# EAGLE schematic unoedge_v1 (EAGLE 7.2.0)
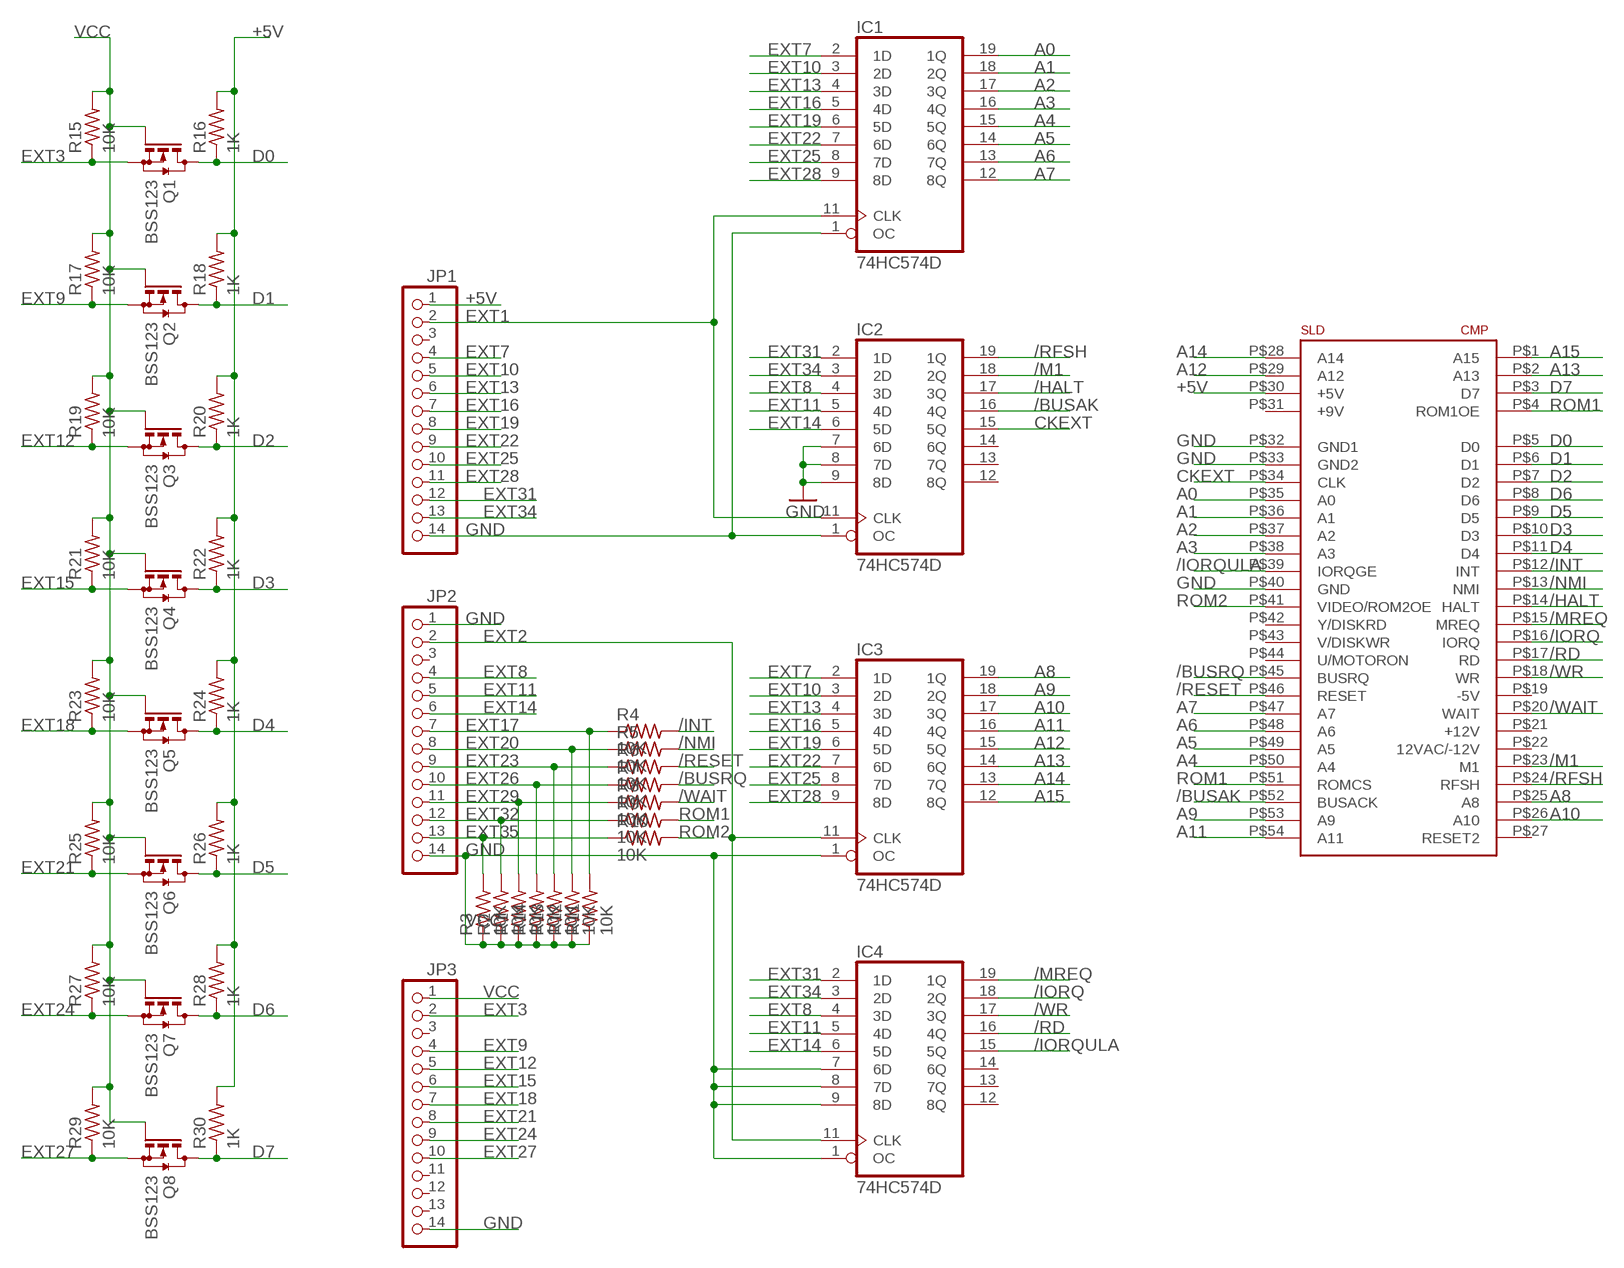
[diagram p0: schematic, sheet 1]

## Parts
IC1  74HC574D  [SO20W]
IC2  74HC574D  [SO20W]
IC3  74HC574D  [SO20W]
IC4  74HC574D  [SO20W]
JP1  PINHD-1X14  [1X14]
JP2  PINHD-1X14  [1X14]
JP3  PINHD-1X14  [1X14]
Q1  BSS123  [SOT23]
Q2  BSS123  [SOT23]
Q3  BSS123  [SOT23]
Q4  BSS123  [SOT23]
Q5  BSS123  [SOT23]
Q6  BSS123  [SOT23]
Q7  BSS123  [SOT23]
Q8  BSS123  [SOT23]
R1  10K  R-US_R0805  [R0805]
R2  10K  R-US_R0805  [R0805]
R3  10K  R-US_R0805  [R0805]
R4  10K  R-US_R0805  [R0805]
R5  10K  R-US_R0805  [R0805]
R6  10K  R-US_R0805  [R0805]
R7  10K  R-US_R0805  [R0805]
R8  10K  R-US_R0805  [R0805]
R9  10K  R-US_R0805  [R0805]
R10  10K  R-US_R0805  [R0805]
R11  10K  R-US_R0805  [R0805]
R12  10K  R-US_R0805  [R0805]
R13  10K  R-US_R0805  [R0805]
R14  10K  R-US_R0805  [R0805]
R15  10K  R-US_R0805  [R0805]
R16  1K  R-US_R0805  [R0805]
R17  10K  R-US_R0805  [R0805]
R18  1K  R-US_R0805  [R0805]
R19  10K  R-US_R0805  [R0805]
R20  1K  R-US_R0805  [R0805]
R21  10K  R-US_R0805  [R0805]
R22  1K  R-US_R0805  [R0805]
R23  10K  R-US_R0805  [R0805]
R24  1K  R-US_R0805  [R0805]
R25  10K  R-US_R0805  [R0805]
R26  1K  R-US_R0805  [R0805]
R27  10K  R-US_R0805  [R0805]
R28  1K  R-US_R0805  [R0805]
R29  10K  R-US_R0805  [R0805]
R30  1K  R-US_R0805  [R0805]
U$2  CONECTOR_EDGE_LADO_SPECTRUM  [CONECTOR_LADO_SPECTRUM]

## Nets
+5V: JP1.1 R16.2 R18.2 R20.2 R22.2 R24.2 R26.2 R28.2 R30.2 U$2.P$30(+5V)
/BUSAK: IC2.16(4Q) U$2.P$52(BUSACK)
/BUSRQ: R7.2 U$2.P$45(BUSRQ)
/HALT: IC2.17(3Q) U$2.P$14(HALT)
/INT: R4.2 U$2.P$12(INT)
/IORQ: IC4.18(2Q) U$2.P$16(IORQ)
/IORQULA: IC4.15(5Q) U$2.P$39(IORQGE)
/M1: IC2.18(2Q) U$2.P$23(M1)
/MREQ: IC4.19(1Q) U$2.P$15(MREQ)
/NMI: R5.2 U$2.P$13(NMI)
/RD: IC4.16(4Q) U$2.P$17(RD)
/RESET: R6.2 U$2.P$46(RESET)
/RFSH: IC2.19(1Q) U$2.P$24(RFSH)
/WAIT: R8.2 U$2.P$20(WAIT)
/WR: IC4.17(3Q) U$2.P$18(WR)
A0: IC1.19(1Q) U$2.P$35(A0)
A1: IC1.18(2Q) U$2.P$36(A1)
A2: IC1.17(3Q) U$2.P$37(A2)
A3: IC1.16(4Q) U$2.P$38(A3)
A4: IC1.15(5Q) U$2.P$50(A4)
A5: IC1.14(6Q) U$2.P$49(A5)
A6: IC1.13(7Q) U$2.P$48(A6)
A7: IC1.12(8Q) U$2.P$47(A7)
A8: IC3.19(1Q) U$2.P$25(A8)
A9: IC3.18(2Q) U$2.P$53(A9)
A10: IC3.17(3Q) U$2.P$26(A10)
A11: IC3.16(4Q) U$2.P$54(A11)
A12: IC3.15(5Q) U$2.P$29(A12)
A13: IC3.14(6Q) U$2.P$2(A13)
A14: IC3.13(7Q) U$2.P$28(A14)
A15: IC3.12(8Q) U$2.P$1(A15)
CKEXT: IC2.15(5Q) U$2.P$34(CLK)
D0: Q1.3(D) R16.1 U$2.P$5(D0)
D1: Q2.3(D) R18.1 U$2.P$6(D1)
D2: Q3.3(D) R20.1 U$2.P$7(D2)
D3: Q4.3(D) R22.1 U$2.P$10(D3)
D4: Q5.3(D) R24.1 U$2.P$11(D4)
D5: Q6.3(D) R26.1 U$2.P$9(D5)
D6: Q7.3(D) R28.1 U$2.P$8(D6)
D7: Q8.3(D) R30.1 U$2.P$3(D7)
EXT1: IC1.11(CLK) IC2.11(CLK) JP1.2
EXT2: IC3.11(CLK) IC4.11(CLK) JP2.2
EXT3: JP3.2 Q1.2(S) R15.1
EXT7: IC1.2(1D) IC3.2(1D) JP1.4
EXT8: IC2.4(3D) IC4.4(3D) JP2.4
EXT9: JP3.4 Q2.2(S) R17.1
EXT10: IC1.3(2D) IC3.3(2D) JP1.5
EXT11: IC2.5(4D) IC4.5(4D) JP2.5
EXT12: JP3.5 Q3.2(S) R19.1
EXT13: IC1.4(3D) IC3.4(3D) JP1.6
EXT14: IC2.6(5D) IC4.6(5D) JP2.6
EXT15: JP3.6 Q4.2(S) R21.1
EXT16: IC1.5(4D) IC3.5(4D) JP1.7
EXT17: JP2.7 R4.1 R11.2
EXT18: JP3.7 Q5.2(S) R23.1
EXT19: IC1.6(5D) IC3.6(5D) JP1.8
EXT20: JP2.8 R5.1 R12.2
EXT21: JP3.8 Q6.2(S) R25.1
EXT22: IC1.7(6D) IC3.7(6D) JP1.9
EXT23: JP2.9 R6.1 R13.2
EXT24: JP3.9 Q7.2(S) R27.1
EXT25: IC1.8(7D) IC3.8(7D) JP1.10
EXT26: JP2.10 R7.1 R14.2
EXT27: JP3.10 Q8.2(S) R29.1
EXT28: IC1.9(8D) IC3.9(8D) JP1.11
EXT29: JP2.11 R1.2 R8.1
EXT31: IC2.2(1D) IC4.2(1D) JP1.12
EXT32: JP2.12 R2.2 R9.1
EXT34: IC2.3(2D) IC4.3(2D) JP1.13
EXT35: JP2.13 R3.2 R10.1
GND: IC1.1(OC) IC2.1(OC) IC2.7(6D) IC2.8(7D) IC3.1(OC) IC4.1(OC) IC4.7(6D) IC4.8(7D) IC4.9(8D) JP1.14 JP2.1 JP2.14 JP3.14 R1.1 R2.1 R3.1 R11.1 R12.1 R13.1 R14.1 U$2.P$32(GND1) U$2.P$33(GND2) U$2.P$40(GND)
ROM1: R9.2 U$2.P$4(ROM1OE) U$2.P$51(ROMCS)
ROM2: R10.2 U$2.P$41(VIDEO/ROM2OE)
VCC: JP3.1 Q1.1(G) Q2.1(G) Q3.1(G) Q4.1(G) Q5.1(G) Q6.1(G) Q7.1(G) Q8.1(G) R15.2 R17.2 R19.2 R21.2 R23.2 R25.2 R27.2 R29.2
Unconnected: IC2.9(8D) IC2.12(8Q) IC2.13(7Q) IC2.14(6Q) IC4.12(8Q) IC4.13(7Q) IC4.14(6Q) JP1.3 JP2.3 JP3.3 JP3.11 JP3.12 JP3.13 U$2.P$19(-5V) U$2.P$21(+12V) U$2.P$22(12VAC/-12V) U$2.P$27(RESET2) U$2.P$31(+9V) U$2.P$42(Y/DISKRD) U$2.P$43(V/DISKWR) U$2.P$44(U/MOTORON)

## Power pins joined to a net without a drawn wire
GND: IC1.10(GND) IC2.10(GND) IC3.10(GND) IC4.10(GND)
VCC: IC1.20(VCC) IC2.20(VCC) IC3.20(VCC) IC4.20(VCC)

## Library data of the parts
IC1-IC4 = 74xx-eu:74*574: 8-bit D type FLIP FLOP bus driver
JP1-JP3 = pinhead:PINHD-1X14: PIN HEADER
Q1-Q8 = transistor-small-signal:BSS123: N-CHANNEL MOS FET
R1-R30 = resistor:R-US_: RESISTOR, American symbol
U$2 = zx_bus_connector_lado_spectrum:CONECTOR_EDGE_LADO_SPECTRUM